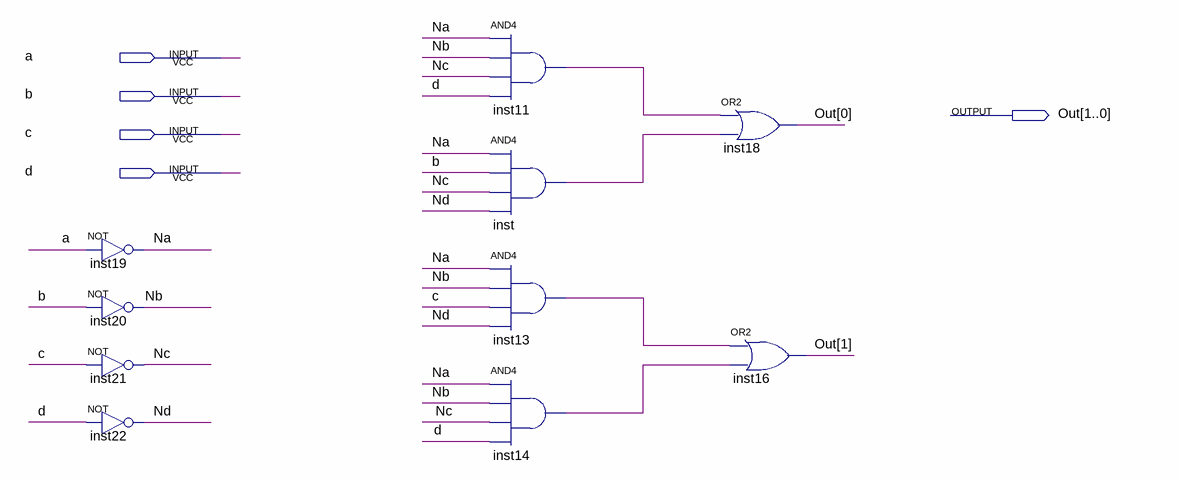
[diagram p0: schematic sheet]
// Quartus schematic ENCOD_4x2.bdf as structural Verilog: 10 symbols, 5 pins
module ENCOD_4x2 (
  input  a,
  input  b,
  input  c,
  input  d,
  output [1:0] Out
);

  wire inst11_out, inst13_out, inst14_out, inst_out, Na, Nb, Nc, Nd;

  not inst19 (Na, a);
  not inst20 (Nb, b);
  not inst21 (Nc, c);
  not inst22 (Nd, d);
  and inst11 (inst11_out, Na, Nb, Nc, d);
  and inst (inst_out, Na, b, Nc, Nd);
  and inst13 (inst13_out, Na, Nb, c, Nd);
  and inst14 (inst14_out, Na, Nb, Nc, d);
  or inst18 (Out[0], inst11_out, inst_out);
  or inst16 (Out[1], inst13_out, inst14_out);
endmodule
